# Altium project Serial Board.PrjPcb
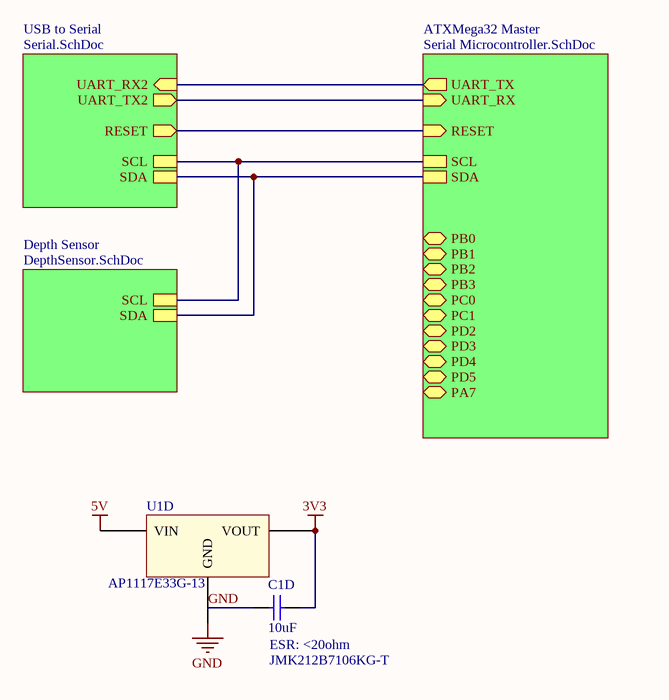
[diagram p0: Serial Board Overview.SchDoc]
4 sheets, 27 parts. Net scope: hierarchical (ports join the sheet entries above them; power ports are global).
Board file: SerialBoard.PcbDoc
Sheets:
  Serial Board Overview.SchDoc
    USB to Serial = Serial.SchDoc
    ATXMega32 Master = Serial Microcontroller.SchDoc
    Depth Sensor = DepthSensor.SchDoc

## Sheet Serial Board Overview.SchDoc
size A; Organization: Underwater Robotics; Address1: c/o Student Involvement; Address2: Campus Box 7306; Address3: 2016 Cates Ave. Raleigh, NC 27695; Revision: A1; SheetNumber: 1D; SheetTotal: 4D

### Parts
C1D  value 10uF  ESR: <20ohm  Manufacturer Part Number: JMK212B7106KG-T  [C0805]  (hidden comment: .1uF)
U1D  AP1117E33G-13  [AP1117]

### Sub-sheets
ATXMega32 Master = Serial Microcontroller.SchDoc: UART_TX (out), UART_RX (in), RESET (in), SCL, SDA, PC1 (bidir), PA7 (bidir), PD5 (bidir), PB2 (bidir), PD3 (bidir), PB0 (bidir), PC0 (bidir), PD4 (bidir), PB1 (bidir), PD2 (bidir), PB3 (bidir)
Depth Sensor = DepthSensor.SchDoc: SDA, SCL
USB to Serial = Serial.SchDoc: UART_RX2 (in), UART_TX2 (out), RESET (out), SCL, SDA

### Nets
3V3: C1D.1 U1D.VOUT
5V: U1D.VIN
GND: C1D.2 U1D.GND
RESET: sheet USB to Serial/RESET, sheet ATXMega32 Master/RESET
SCL: sheet USB to Serial/SCL, sheet ATXMega32 Master/SCL, sheet Depth Sensor/SCL
SDA: sheet USB to Serial/SDA, sheet ATXMega32 Master/SDA, sheet Depth Sensor/SDA
UART_RX: sheet USB to Serial/UART_TX2, sheet ATXMega32 Master/UART_RX
UART_RX2: sheet USB to Serial/UART_RX2, sheet ATXMega32 Master/UART_TX

### Notes on the sheet
- Title
- Size:
- Date:
- A
- Number:
- Time:
- Revision:
- Sheet
- of
- File:

### Library data of the parts
C1D = Cap: Unpolarized Capacitor; Manufacturer 1: TAIYO YUDEN; Description 1: TAIYO YUDEN - JMK212B7106KG-T - CERAMIC CAPACITOR, 10UF, 6.3V, X7R, 10%, 0805; Product Range: M Series; Capacitance: 10 F; Capacitance Tolerance: 10%; Dielectric Characteristic: X7; Voltage Rating: 6.3; Ceramic Capacitor Case: 0805 [2012 Metric]; Supplier 1: Newark; Supplier Part Number 1: 84R9126; RoHS: YES; Stock 1: 492; Pricing 1: 1=0.13, 10=0.12, 50=0.112, 100=0.105, 500=0.083, 1000=0.068 (USD); Packaging: Cut Tape; ComponentLink1URL: http://www.farnell.com/datasheets/1910934.pdf; ComponentLink1Description: http://www.farnell.com/datasheets/1910934.pdf
U1D = AP1117E33G-13: 3.3V 1A Linear Regulator; Manufacturer 1: DIODES INC.; Description 1: DIODES INC. - AP1117E33G-13 - IC, LDO, REG, 3.3V, SOT223; Input Voltage Min: 4.8; Input Voltage Max: 18; Output Voltage Nom.: 3.3; Output Current: 1; Dropout Voltage Vdo: 1.3; LDO Regulator Case Style: SOT-223; No. of Pins: 3; Supplier 1: Newark; Supplier Part Number 1: 79R5845; Manufacturer Part Number: AP1117E33G-13; RoHS: YES; Stock 1: 8573; Pricing 1: 1=0.444, 10=0.324, 100=0.204, 250=0.151, 500=0.123, 1000=0.095 (USD); Operating Temperature Min: 0; ComponentLink1URL: http://www.farnell.com/datasheets/608751.pdf; ComponentLink1Description: http://www.farnell.com/datasheets/608751.pdf

## Sheet Serial.SchDoc
size A; PageSetup: Record=PageOptions|CenterHorizontal=True|CenterVertical=True|PrintScale=1.00|XCorrection=1.00|YCorrection=1.00|PrintKind=1|BorderSize=5000000|LeftOffset=0|BottomOffset=0|Orientation=2|PaperLength=1000|PaperWidth=1000|Scale=100|PaperSource=7|PrintQuality=-4|MediaType=1|DitherType=10|PaperKind=Letter 8.5"x11" 22x28cm|PrintScaleMode=1; Organization: Underwater Robotics; Address1: c/o Student Involvement; Address2: Campus Box 7306; Address3: 2016 Cates Ave. Raleigh, NC 27695; Revision: A1; SheetNumber: 3D; SheetTotal: 4D
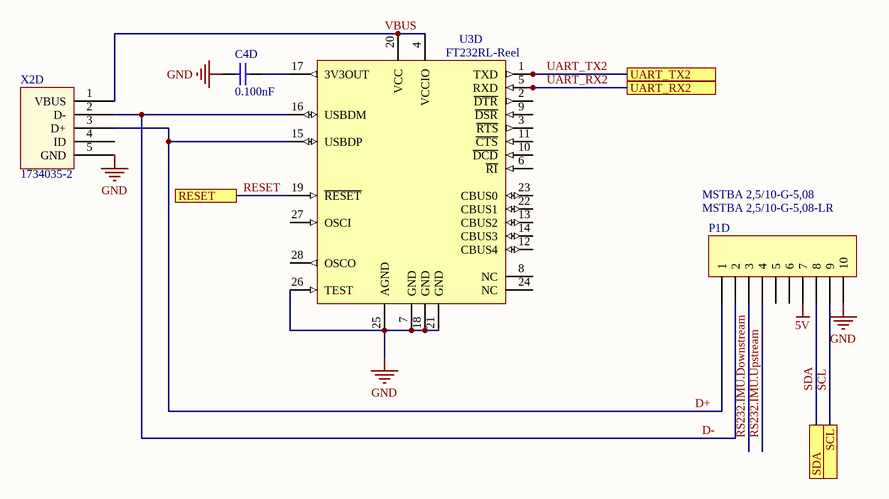
[diagram p1: Serial.SchDoc]

### Parts
C4D  value 0.100nF  [C0805]  (hidden comment: Cap)
P1D  MSTBA 2,5/10-G-5,08  Manufacturer Part Number: MSTBA 2,5/10-G-5,08-LR  [MSTBA 2,5/10-G-5,08]
U3D  FT232RL-Reel  [SSOP-28_N]
X2D  Manufacturer Part Number: 1734035-2  [UX60-MB-5ST]  (hidden comment: USB Mini Jack)

### Ports
RESET, SCL, SDA, UART_RX2, UART_TX2

### Nets
5V: P1D.7
GND: C4D.2 P1D.10 U3D.7(GND) U3D.18(GND) U3D.21(GND) U3D.25(AGND) U3D.26(TEST) X2D.5(GND)
D+: P1D.1 U3D.15(USBDP) X2D.3(D+)
D-: P1D.2 U3D.16(USBDM) X2D.2(D-)
RESET: U3D.19(~{RESET}) ; port RESET
RS232.IMU.Downstream: P1D.3
RS232.IMU.Upstream: P1D.4
SCL: P1D.9 ; port SCL
SDA: P1D.8 ; port SDA
UART_RX2: U3D.5(RXD) ; port UART_RX2
UART_TX2: U3D.1(TXD) ; port UART_TX2  [project net UART_RX]
VBUS: U3D.4(VCCIO) U3D.20(VCC) X2D.1(VBUS)
NetC4D_1: C4D.1 U3D.17(3V3OUT)

Not connected (* = marked no-connect by the designer): P1D 5 6; U3D 2(~{DTR}) 3(~{RTS}) 6(~{RI}) 8(NC) 9(~{DSR}) 10(~{DCD}) 11(~{CTS}) 12(CBUS4) 13(CBUS2) 14(CBUS3) 22(CBUS1) 23(CBUS0) 24(NC) 27(OSCI) 28(OSCO); X2D 4(ID)

### Notes on the sheet
- Title
- Size:
- Date:
- A
- Number:
- Time:
- Revision:
- Sheet
- of
- File:

### Library data of the parts
C4D = Cap: Unpolarized Capacitor
P1D = MSTBA 2,5/10-G-5,08: Header, 10-Pin; Manufacturer 1: PHOENIX CONTACT; Description 1: PHOENIX CONTACT - MSTBA 2,5/10-G-5,08-LR - TERMINAL BLOCK, HEADER, 10POS, TH; URL: http://www.mouser.com/ProductDetail/Phoenix-Contact/1792708/?qs=sGAEpiMZZMsDddcp1dBDJI66tvLKBAoKnRJwuCPjeJk%3d; Supplier 1: Newark; Supplier Part Number 1: 88W5041; RoHS: YES; Stock 1: 37; Pricing 1: 1=3.07, 100=2.89, 250=2.67, 500=2.55, 1000=2.27 (USD); ComponentLink1URL: http://www.farnell.com/datasheets/1702208.pdf; ComponentLink1Description: http://www.farnell.com/datasheets/1702208.pdf
U3D = FT232RL-Reel: USB UART Asynchronous Serial Data Transfer Chip, 28-pin SSOP, Tape and Reel; Manufacturer: FTDI; DatasheetVersion: ver 2.10, Mar-2012; PackageVersion: Mar-12; PackageReference: SSOP-28; PackageDescription: 28-Pin Small Outline Package 0.65 mm Pitch; PartNumber: FT232RL-Reel; ComponentLink1Description: Manufacturer URL; ComponentLink1URL: http://www.ftdichip.com/; ComponentLink2Description: Datasheet; ComponentLink2URL: http://www.ftdichip.com/Support/Documents/DataSheets/ICs/DS_FT232R.pdf
X2D = USB-MINI: USB Mini connector; Manufacturer 1: TE CONNECTIVITY; Description 1: TE CONNECTIVITY - 1734035-2 - MINI USB, 2.0 TYPE B, RECEPTACLE, SMT; Supplier Part Number 1: 16M3869; Supplier 1: Newark; RoHS: YES; Stock 1: 6729; Pricing 1: 1=1.08, 25=0.989, 50=0.989, 100=0.989, 200=0.989 (USD); ComponentLink1URL: http://www.farnell.com/datasheets/1650952.pdf; ComponentLink1Description: http://www.farnell.com/datasheets/1650952.pdf; ComponentLink2URL: http://www.farnell.com/cad/1650238.tif; ComponentLink2Description: http://www.farnell.com/cad/1650238.tif; ComponentLink3URL: http://www.farnell.com/datasheets/1665303.pdf; ComponentLink3Description: http://www.farnell.com/datasheets/1665303.pdf

## Sheet Serial Microcontroller.SchDoc
size A; Organization: Underwater Robotics; Address1: c/o Student Involvement; Address2: Campus Box 7306; Address3: 2016 Cates Ave. Raleigh, NC 27695; Revision: A1; SheetNumber: 2D; SheetTotal: 4D
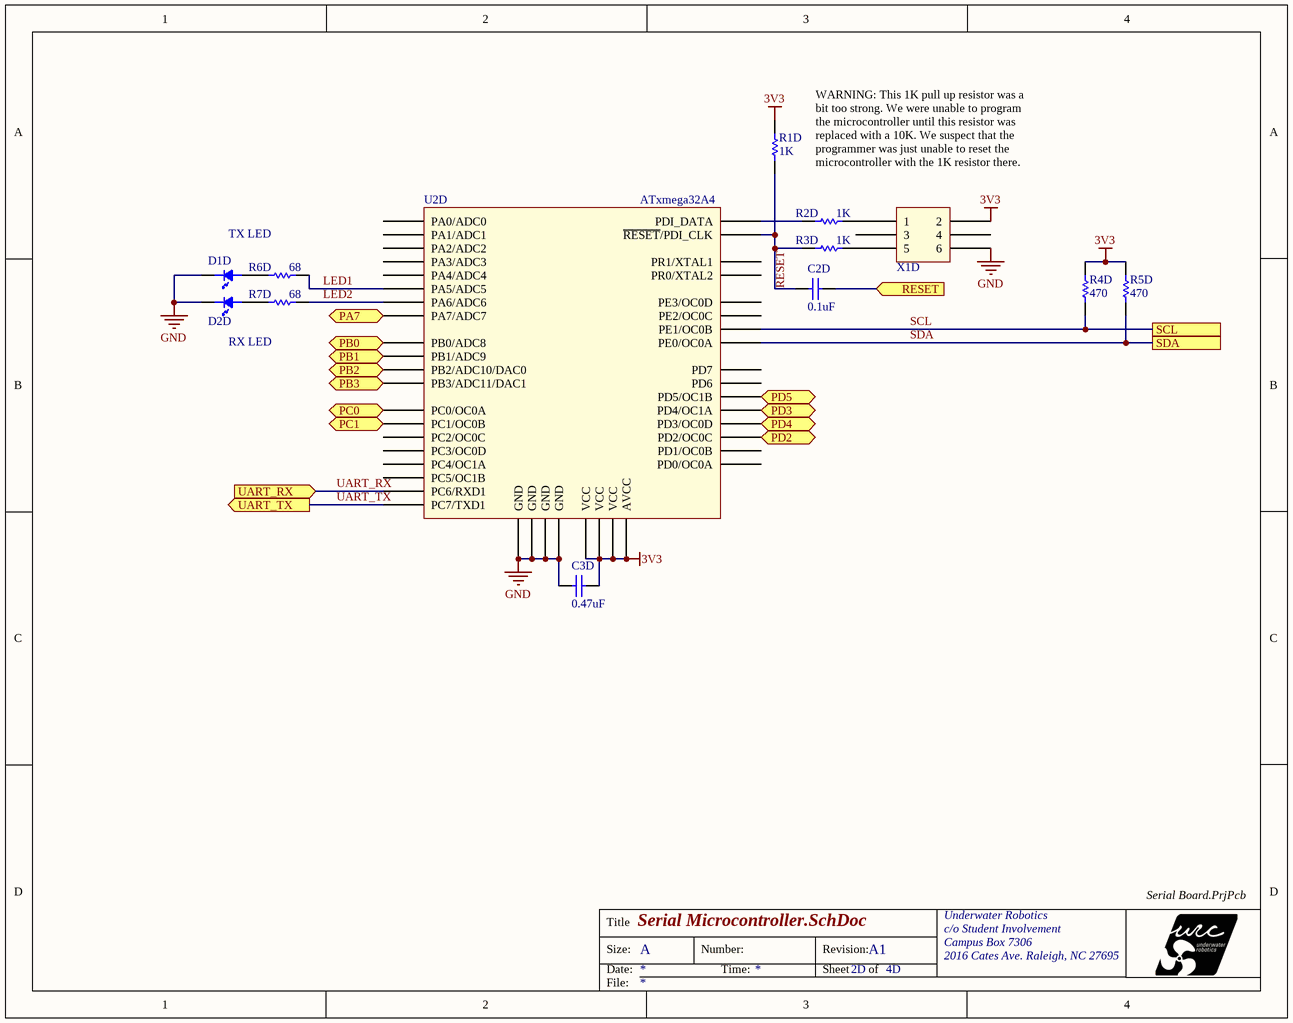
[diagram p2: Serial Microcontroller.SchDoc]

### Parts
C2D  value 0.1uF  [C0805]  (hidden comment: Cap)
C3D  value 0.47uF  [C0805]  (hidden comment: Cap)
D1D  LED  [LED0805]  (value not drawn)
D2D  LED  [LED0805]  (value not drawn)
R1D  value 1K  [R0805]  (hidden comment: Resistor)
R2D  value 1K  [R0805]  (hidden comment: Resistor)
R3D  value 1K  [R0805]  (hidden comment: Resistor)
R4D  value 470  [R0805]  (hidden comment: Resistor)
R5D  value 470  [R0805]  (hidden comment: Resistor)
R6D  value 68  [R0805]  (hidden comment: Resistor)
R7D  value 68  [R0805]  (hidden comment: Resistor)
U2D  ATxmega32A4  [ATxmegaA4-TQFP44]
X1D  Header  [2x3 Header]  (value not drawn)

### Ports
PA7 (bidir), PB0 (bidir), PB1 (bidir), PB2 (bidir), PB3 (bidir), PC0 (bidir), PC1 (bidir), PD2 (bidir), PD3 (bidir), PD4 (bidir), PD5 (bidir), RESET (in), SCL, SDA, UART_RX (in), UART_TX (out)

### Nets
3V3: C3D.2 R1D.2 R4D.2 R5D.2 U2D.9(VCC) U2D.19(VCC) U2D.31(VCC) U2D.39(AVCC) X1D.2
GND: C3D.1 D1D.1 D2D.1 U2D.8(GND) U2D.18(GND) U2D.30(GND) U2D.38(GND) X1D.6
LED1: R6D.2 U2D.1(PA5/ADC5)
LED2: R7D.2 U2D.2(PA6/ADC6)
RESET: C2D.1 ; port RESET
RESET: C2D.2 R1D.1 R3D.1 U2D.35(~{RESET}/PDI_CLK)  [a separate net that carries the same name]
SCL: R4D.1 U2D.29(PE1/OC0B) ; port SCL
SDA: R5D.1 U2D.28(PE0/OC0A) ; port SDA
UART_RX: U2D.16(PC6/RXD1) ; port UART_RX
UART_TX: U2D.17(PC7/TXD1) ; port UART_TX  [project net UART_RX2]
NetD1D_2: D1D.2 R6D.1
NetD2D_2: D2D.2 R7D.1
NetR2D_1: R2D.1 U2D.34(PDI_DATA)
NetR2D_2: R2D.2 X1D.1
NetR3D_2: R3D.2 X1D.5
NetU2D_3: U2D.3(PA7/ADC7) ; port PA7
NetU2D_4: U2D.4(PB0/ADC8) ; port PB0
NetU2D_5: U2D.5(PB1/ADC9) ; port PB1
NetU2D_6: U2D.6(PB2/ADC10/DAC0) ; port PB2
NetU2D_7: U2D.7(PB3/ADC11/DAC1) ; port PB3
NetU2D_10: U2D.10(PC0/OC0A) ; port PC0
NetU2D_11: U2D.11(PC1/OC0B) ; port PC1
NetU2D_22: U2D.22(PD2/OC0C) ; port PD2
NetU2D_23: U2D.23(PD3/OC0D) ; port PD4
NetU2D_24: U2D.24(PD4/OC1A) ; port PD3
NetU2D_25: U2D.25(PD5/OC1B) ; port PD5

Not connected (* = marked no-connect by the designer): U2D 12(PC2/OC0C) 13(PC3/OC0D) 14(PC4/OC1A) 15(PC5/OC1B) 20(PD0/OC0A) 21(PD1/OC0B) 26(PD6) 27(PD7) 32(PE2/OC0C) 33(PE3/OC0D) 36(PR0/XTAL2) 37(PR1/XTAL1) 40(PA0/ADC0) 41(PA1/ADC1) 42(PA2/ADC2) 43(PA3/ADC3) 44(PA4/ADC4); X1D 3 4

### Notes on the sheet
- TX LED
- WARNING: This 1K pull up resistor was a bit too strong. We were unable to program the microcontroller until this resistor was replaced with a 10K. We suspect that the programmer was just unable to reset the microcontroller with the 1K resistor there.
- RX LED
- Title
- Size:
- Date:
- A
- Number:
- Time:
- Revision:
- Sheet
- of
- File:

### Library data of the parts
C2D C3D = Cap: Unpolarized Capacitor
R1D R2D R3D R4D R5D R6D R7D = Res: Tolerance: 5%
U2D = ATxmegaA4: Manufacturer 1: ATMEL; Manufacturer Part Number: ATXMEGA32A4-AU; Description 1: ATMEL - ATXMEGA32A4-AU - MICROCONTROLLER MCU, 8 BIT, AVR XMEGA, 32MHZ, TQFP-44; CPU Speed: 32; RAM Memory Size: 4; No. of Pins: 44; MCU Case Style: TQFP; No. of I/O's: 34; Supply Voltage Min: 1.6; Supplier 1: Newark; Supplier Part Number 1: 68T3938; RoHS: YES; Stock 1: 376; Pricing 1: 1=6.13, 10=5.5, 25=5.01, 50=4.54, 100=4.24, 250=4.11, 500=3.8, 1000=3.53 (USD); Controller Family/Series: ATxmega; Program Memory Size: 32; ComponentLink1URL: http://www.farnell.com/datasheets/1734580.pdf; ComponentLink1Description: http://www.farnell.com/datasheets/1734580.pdf; ComponentLink2URL: http://www.farnell.com/cad/1773773.zip; ComponentLink2Description: http://www.farnell.com/cad/1773773.zip; ComponentLink3URL: http://bcove.me/gu8hm7kh; ComponentLink3Description: http://bcove.me/gu8hm7kh
X1D = 2x3 Header: Manufacturer 1: FCI; Manufacturer Part Number: 67996-406HLF; Description 1: FCI - 67996-406HLF - BOARD-BOARD CONNECTOR HEADER, 6 POSITION, 2ROW; Product Range: BergStik 67996 Series; Contact Termination Type: Through Hole; No. of Contacts: 6; Pitch Spacing: 2.54; No. of Rows: 2; Supplier Part Number 1: 20M2191; Supplier 1: Newark; RoHS: YES; Stock 1: 441; Pricing 1: 1=0.254, 10=0.218, 25=0.186, 50=0.178, 100=0.16, 250=0.153, 500=0.128, 1000=0.117 (USD); Gender: Header; Contact Plating: Tin Plated Contacts; ComponentLink1URL: http://www.farnell.com/datasheets/1876884.pdf; ComponentLink1Description: http://www.farnell.com/datasheets/1876884.pdf

## Sheet DepthSensor.SchDoc
size A; SheetNumber: 4D; SheetTotal: 4D
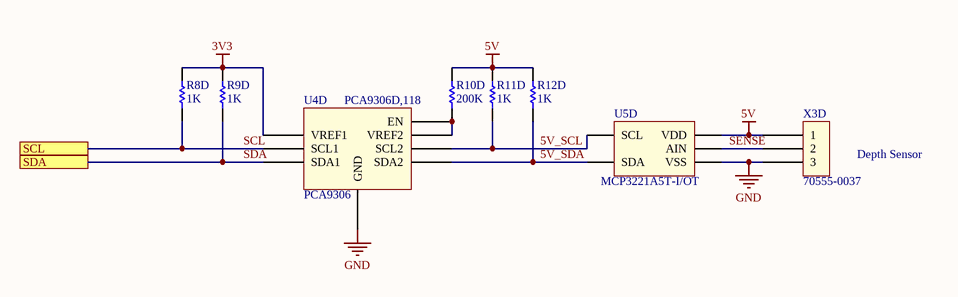
[diagram p3: DepthSensor.SchDoc]

### Parts
R8D  value 1K  [R0805]  (hidden comment: Resistor)
R9D  value 1K  [R0805]  (hidden comment: Resistor)
R10D  value 200K  [R0805]  (hidden comment: Resistor)
R11D  value 1K  [R0805]  (hidden comment: Resistor)
R12D  value 1K  [R0805]  (hidden comment: Resistor)
U4D  PCA9306  Manufacturer Part Number: PCA9306D,118  [PCA9306-SO8]
U5D  Manufacturer Part Number: MCP3221A5T-I/OT  [MCP3221-SOT23-5]
X3D  70555-0037  [70555-0037]

### Ports
SCL, SDA

### Nets
3V3: R8D.2 R9D.2 U4D.VREF1
5V: R10D.2 R11D.2 R12D.2 U5D.VDD X3D.1
GND: U4D.GND U5D.VSS X3D.3
5V_SCL: R11D.1 U4D.SCL2 U5D.SCL
5V_SDA: R12D.1 U4D.SDA2 U5D.SDA
SCL: R8D.1 U4D.SCL1 ; port SCL
SDA: R9D.1 U4D.SDA1 ; port SDA
SENSE: U5D.AIN X3D.2
NetR10D_1: R10D.1 U4D.EN U4D.VREF2

### Notes on the sheet
- Depth Sensor
- Title
- Size:
- Date:
- A
- Number:
- Time:
- Revision:
- Sheet
- of
- File:

### Library data of the parts
R8D R9D R10D R11D R12D = Res: Tolerance: 5%
U4D = PCA9306: PCA9306, Bidirectional level translator; Manufacturer: NXP; IC Interface Type: I2; Supply Voltage Min: 1; Supply Voltage Max: 3.6; Interface Case Style: SOIC; No. of Pins: 8; Supplier 1: Newark; Supplier Part Number 1: 70R6428; RoHS: YES; Stock 1: 3293; Pricing 1: 1=0.346, 10=0.346, 25=0.346, 100=0.346, 250=0.317, 500=0.317, 1000=0.293, 2500=0.272 (USD); Interface Applications: -; Operating Temperature Min: -40 C; Packaging: Cut Tape; ComponentLink1URL: http://www.nxp.com/packings/SOT96-1_118.html; ComponentLink1Description: http://www.nxp.com/packings/SOT96-1_118.html; ComponentLink2URL: http://www.farnell.com/cad/1549203.zip; ComponentLink2Description: http://www.farnell.com/cad/1549203.zip; ComponentLink3URL: http://www.farnell.com/datasheets/1805226.pdf; ComponentLink3Description: http://www.farnell.com/datasheets/1805226.pdf
U5D = MCP3221: MCP3221, 12 bit ADC, I2C; Manufacturer: MICROCHIP; Resolution (Bits): 12; Sampling Rate: 22.3; Supply Voltage Type: Single; Supply Voltage Min: 2.7; Supply Voltage Max: 5.5; ADC / DAC Case Style: SOT-23; No. of Pins: 5; Supplier 1: Newark; Supplier Part Number 1: 92C2410; RoHS: YES; Stock 1: 2165; Pricing 1: 1=1.44, 26=1.2, 100=1.09 (USD); ComponentLink1URL: http://www.farnell.com/cad/1545531.zip; ComponentLink1Description: http://www.farnell.com/cad/1545531.zip; ComponentLink2URL: http://www.farnell.com/datasheets/12186.pdf; ComponentLink2Description: http://www.farnell.com/datasheets/12186.pdf
X3D = 70555-0037: Molex, C-Grid SL 70555, 3 Pin; Product Range: SL 70555 Series; Contact Termination Type: Through Hole; Gender: Header; No. of Contacts: 3; Pitch Spacing: 2.54; No. of Rows: 1; Supplier 1: Newark; Supplier Part Number 1: 59H2958; Manufacturer: MOLEX; RoHS: YES; Stock 1: 1580; Pricing 1: 1=0.679, 10=0.622, 100=0.575, 500=0.575, 1000=0.534, 2000=0.495, 5000=0.484, 10000=0.47 (USD); Contact Plating: Gold Plated Contacts; ComponentLink1URL: http://www.farnell.com/cad/1737917.pdf; ComponentLink1Description: http://www.farnell.com/cad/1737917.pdf; ComponentLink2URL: http://www.farnell.com/datasheets/1947503.pdf; ComponentLink2Description: http://www.farnell.com/datasheets/1947503.pdf; ComponentLink3URL: http://www.farnell.com/cad/1980011.zip; ComponentLink3Description: http://www.farnell.com/cad/1980011.zip

## Nets that join several sheets
3V3: Serial Board Overview (C1D.1 U1D.VOUT), Serial Microcontroller (9 pins), DepthSensor (R8D.2 R9D.2 U4D.VREF1)
5V: Serial Board Overview (U1D.VIN), Serial (P1D.7), DepthSensor (5 pins)
GND: Serial Board Overview (C1D.2 U1D.GND), Serial (8 pins), Serial Microcontroller (8 pins), DepthSensor (U4D.GND U5D.VSS X3D.3)
RESET: Serial (U3D.19), Serial Microcontroller (C2D.1)
SCL: Serial (P1D.9), Serial Microcontroller (R4D.1 U2D.29), DepthSensor (R8D.1 U4D.SCL1)
SDA: Serial (P1D.8), Serial Microcontroller (R5D.1 U2D.28), DepthSensor (R9D.1 U4D.SDA1)
UART_RX: Serial (U3D.1), Serial Microcontroller (U2D.16)
UART_RX2: Serial (U3D.5), Serial Microcontroller (U2D.17)